# Altium schematic sheet Part H.SchDoc
size A4; SheetNumber: 15; SheetTotal: 16
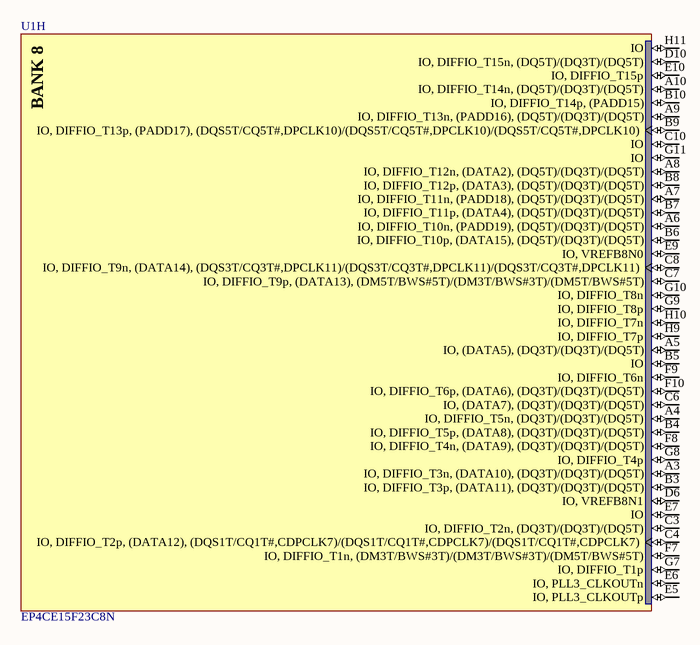
[diagram p0: Part H.SchDoc]

## Parts
U1  EP4CE15F23C8N  [FBGA484_A-240]  (part H of 13)

## Nets

Not connected (* = marked no-connect by the designer): U1 A3(IO,_DIFFIO_T3n,_(DATA10),_(DQ3T)/(DQ3T)/(DQ5T)) A4(IO,_DIFFIO_T5n,_(DQ3T)/(DQ3T)/(DQ5T)) A5(IO,_(DATA5),_(DQ3T)/(DQ3T)/(DQ5T)) A6(IO,_DIFFIO_T10n,_(PADD19),_(DQ5T)/(DQ3T)/(DQ5T)) A7(IO,_DIFFIO_T11n,_(PADD18),_(DQ5T)/(DQ3T)/(DQ5T)) A8(IO,_DIFFIO_T12n,_(DATA2),_(DQ5T)/(DQ3T)/(DQ5T)) A9(IO,_DIFFIO_T13n,_(PADD16),_(DQ5T)/(DQ3T)/(DQ5T)) A10(IO,_DIFFIO_T14n,_(DQ5T)/(DQ3T)/(DQ5T)) B3(IO,_DIFFIO_T3p,_(DATA11),_(DQ3T)/(DQ3T)/(DQ5T)) B4(IO,_DIFFIO_T5p,_(DATA8),_(DQ3T)/(DQ3T)/(DQ5T)) B5(IO) B6(IO,_DIFFIO_T10p,_(DATA15),_(DQ5T)/(DQ3T)/(DQ5T)) B7(IO,_DIFFIO_T11p,_(DATA4),_(DQ5T)/(DQ3T)/(DQ5T)) B8(IO,_DIFFIO_T12p,_(DATA3),_(DQ5T)/(DQ3T)/(DQ5T)) B9(IO,_DIFFIO_T13p,_(PADD17),_(DQS5T/CQ5T#,DPCLK10)/(DQS5T/CQ5T#,DPCLK10)/(DQS5T/CQ5T#,DPCLK10)) B10(IO,_DIFFIO_T14p,_(PADD15)) C3(IO,_DIFFIO_T2n,_(DQ3T)/(DQ3T)/(DQ5T)) C4(IO,_DIFFIO_T2p,_(DATA12),_(DQS1T/CQ1T#,CDPCLK7)/(DQS1T/CQ1T#,CDPCLK7)/(DQS1T/CQ1T#,CDPCLK7)) C6(IO,_(DATA7),_(DQ3T)/(DQ3T)/(DQ5T)) C7(IO,_DIFFIO_T9p,_(DATA13),_(DM5T/BWS#5T)/(DM3T/BWS#3T)/(DM5T/BWS#5T)) C8(IO,_DIFFIO_T9n,_(DATA14),_(DQS3T/CQ3T#,DPCLK11)/(DQS3T/CQ3T#,DPCLK11)/(DQS3T/CQ3T#,DPCLK11)) C10(IO) D6(IO,_VREFB8N1) D10(IO,_DIFFIO_T15n,_(DQ5T)/(DQ3T)/(DQ5T)) E5(IO,_PLL3_CLKOUTp) E6(IO,_PLL3_CLKOUTn) E7(IO) E9(IO,_VREFB8N0) E10(IO,_DIFFIO_T15p) F7(IO,_DIFFIO_T1n,_(DM3T/BWS#3T)/(DM3T/BWS#3T)/(DM5T/BWS#5T)) F8(IO,_DIFFIO_T4n,_(DATA9),_(DQ3T)/(DQ3T)/(DQ5T)) F9(IO,_DIFFIO_T6n) F10(IO,_DIFFIO_T6p,_(DATA6),_(DQ3T)/(DQ3T)/(DQ5T)) G7(IO,_DIFFIO_T1p) G8(IO,_DIFFIO_T4p) G9(IO,_DIFFIO_T8p) G10(IO,_DIFFIO_T8n) G11(IO) H9(IO,_DIFFIO_T7p) H10(IO,_DIFFIO_T7n) H11(IO)

## Notes on the sheet
- (in symbol FPGA_EP4CE15F23C8N, part H) BANK 8

## Library data of the parts
U1 = FPGA_EP4CE15F23C8N: Cyclone IV Family FPGA, 1.2V Core, 343 I/O Pins, 4 PLLs, 484-Pin FBGA, Speed Grade 8, Commercial Grade, Pb-Free; Manufacturer: Altera; PackageVersion: ver1.0, Jun-2011; PackageReference: FBGA484_A-240; ComponentLink3URL: http://www.altera.com/literature/lit-dp.jsp?category=cyc%204&showspreadsheet=y; ComponentLink1Description: Manufacturer URL; DatasheetVersion: ver1.6, Nov-2011; ComponentLink3Description: Pinout; ComponentLink2URL: http://www.altera.com/literature/hb/cyclone-iv/cyclone4-handbook.pdf; ComponentLink1URL: http://www.altera.com/; ComponentLink2Description: Handbook; PackageDescription: 484-Pin FineLine Ball Grid Array (FBGA) - Wire Bond - A:2.40; Code_JEDEC: MS-034-AAJ-1; ComponentLink4URL: http://www.altera.com/devicepackaging/04R00247-02.pdf; ComponentLink4Description: Package Specification